# EAGLE design LightSensor (EAGLE 9.6.2)
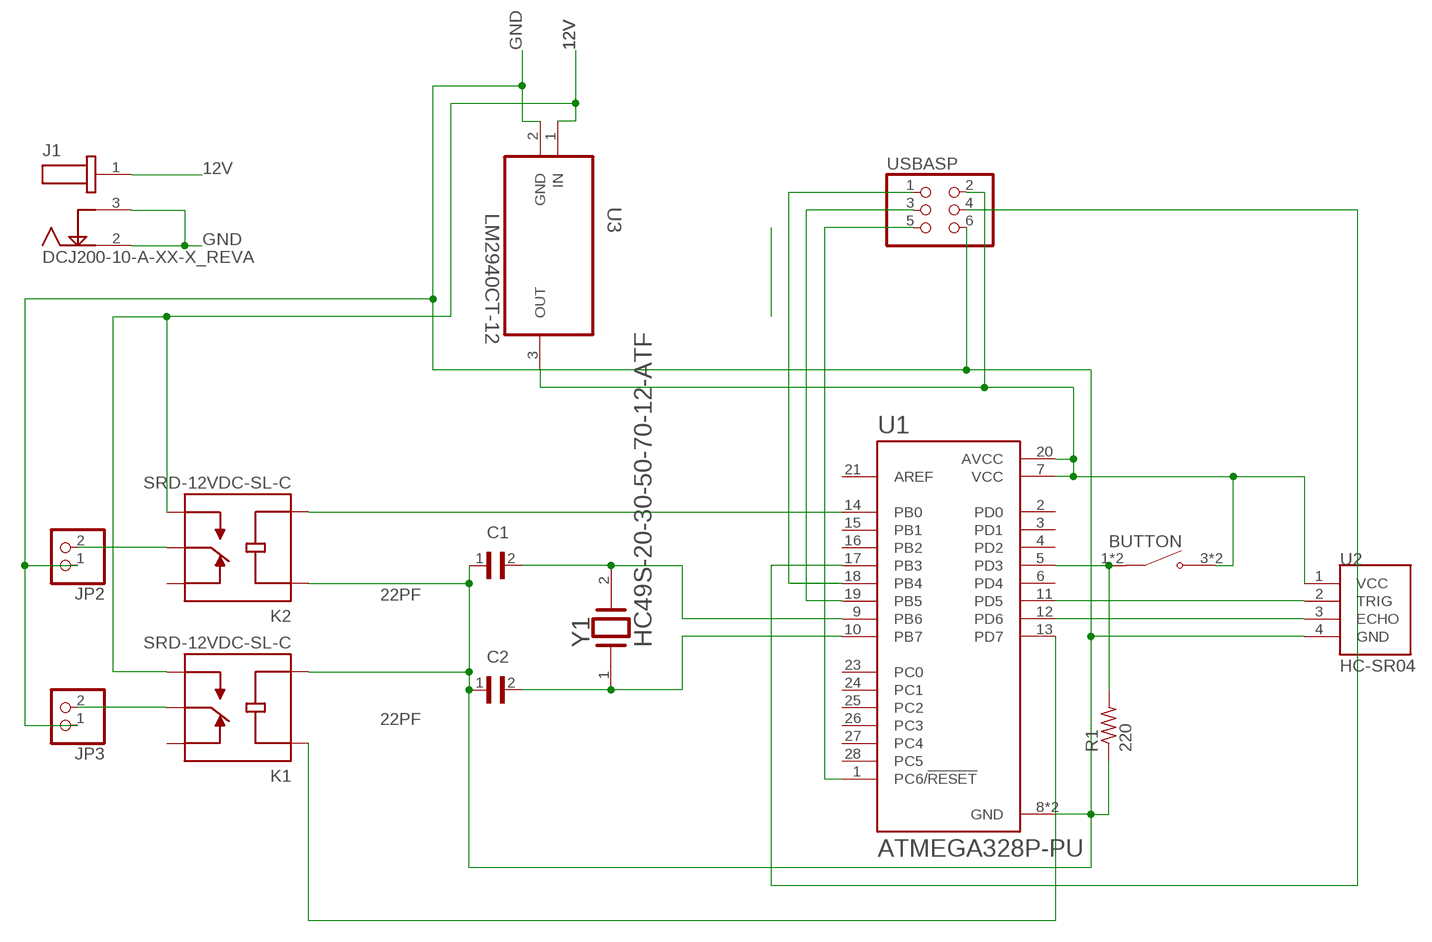
[diagram p0: schematic, sheet 1]

## Parts
C1  22PF  DE21XSA220KN3AX02F  [CAP_DE21XSA220KN3AX02F]
C2  22PF  DE21XSA220KN3AX02F  [CAP_DE21XSA220KN3AX02F]
J1  DCJ200-10-A-XX-X_REVA  [GCT_DCJ200-10-A-XX-X_REVA]
JP2  PINHD-1X2  [1X02]
JP3  PINHD-1X2  [1X02]
K1  SRD-12VDC-SL-C  [RELAY_SRD-12VDC-SL-C]
K2  SRD-12VDC-SL-C  [RELAY_SRD-12VDC-SL-C]
R1  220  R-US_0309/12  [0309/12]
S1  BUTTON  [BUTTON]
U1  ATMEGA328P-PU  [DIP794W46P254L2967H457Q28B]
U2  HC-SR04  [XCVR_HC-SR04]
U3  LM2940CT-12  [TO254P470X1016X2222-3P]
USBASP  PINHD-2X3  [2X03]
Y1  20MHZ  MULTICOMP_HC49S-20-30-50-70-12-ATFMULTICOMP_HC49S-20-30-50-70-12-ATF_0_0  [MULTICOMP_HC49S-20-30-50-70-12-ATF_0]

## Nets
12V: J1.1 K1.NO K2.NO U3.1(IN)
BUTTON: R1.2 S1.1(COM) S1.2(COM) U1.5(PD3)
GND: C1.1 C2.1 J1.2 J1.3 JP2.1 JP3.1 K1.COIL2 K2.COIL1 R1.1 U1.8(GND) U1.22(GND) U2.4(GND) U3.2(GND) USBASP.6
N$2: U1.17(PB3) USBASP.4
N$3: U1.1(PC6/!RESET) USBASP.5
N$4: U1.19(PB5) USBASP.3
N$6: U1.18(PB4) USBASP.1
N$7: C1.2 U1.9(PB6) Y1.2
N$8: C2.2 U1.10(PB7) Y1.1
N$9: U1.11(PD5) U2.2(TRIG)
N$10: U1.12(PD6) U2.3(ECHO)
N$11: K1.COIL1 U1.13(PD7)
N$12: K2.COIL2 U1.14(PB0)
N$13: JP2.2 K2.COM
N$14: JP3.2 K1.COM
N$15: S1.3(NO) S1.4(NO) U1.7(VCC) U1.20(AVCC) U2.1(VCC) U3.3(OUT) USBASP.2
Unconnected: K1.NC K2.NC U1.2(PD0) U1.3(PD1) U1.4(PD2) U1.6(PD4) U1.15(PB1) U1.16(PB2) U1.21(AREF) U1.23(PC0) U1.24(PC1) U1.25(PC2) U1.26(PC3) U1.27(PC4) U1.28(PC5)

## Library data of the parts
C1 C2 = DE21XSA220KN3AX02F:DE21XSA220KN3AX02F: Check prices <https://pricing.snapeda.com/parts/DE21XSA220KN3AX02F/Murata%20Electronics/view-part?ref=eda>; AVAILABILITY: In Stock; DESCRIPTION: 22pF ±10% 300VAC Ceramic Capacitor SL Radial, Disc; MF: Murata Electronics; MP: DE21XSA220KN3AX02F; PACKAGE: NONSTANDARD; PRICE: None; PURCHASE-URL: https://pricing.snapeda.com/search/part/DE21XSA220KN3AX02F/?ref=eda
J1 = DCJ200-10-A-XX-X_REVA:DCJ200-10-A-XX-X_REVA: DC Power Jack, Thru-Hole, Horizontal, with Locating Pegs, D2.0mm Check prices <https://pricing.snapeda.com/parts/DCJ200-10-A-K1-K/Global%20Connector%20Technology/view-part?ref=eda>; AVAILABILITY: In Stock; DESCRIPTION: Power Barrel Connector Jack 2.05mm ID (0.081), 5.50mm OD (0.217) Through Hole, Right Angle; MF: Global Connector Technology; MP: DCJ200-10-A-K1-K; PACKAGE: None; PRICE: None; PURCHASE-URL: https://pricing.snapeda.com/search/part/DCJ200-10-A-K1-K/?ref=eda
JP2 JP3 = pinhead:PINHD-1X2: PIN HEADER
K1 = SRD-12VDC-SL-C:SRD-12VDC-SL-C: General Purpose Non Latching 12VDC SPDT Through Hole Relays RoHS Check prices <https://pricing.snapeda.com/parts/SRD-12VDC-SL-C/Songle%20Relay/view-part?ref=eda>; AVAILABILITY: No availability data; DESCRIPTION: General Purpose Non Latching 12VDC SPDT Through Hole Relays RoHS; MF: Songle Relay; MP: SRD-12VDC-SL-C; PACKAGE: Package; PRICE: None; SPICEPREFIX: X
K2 = SRD-12VDC-SL-C:SRD-12VDC-SL-C: General Purpose Non Latching 12VDC SPDT Through Hole Relays RoHS Check prices <https://pricing.snapeda.com/parts/SRD-12VDC-SL-C/Songle%20Relay/view-part?ref=eda>; AVAILABILITY: No availability data; DESCRIPTION: General Purpose Non Latching 12VDC SPDT Through Hole Relays RoHS; MF: Songle Relay; MP: SRD-12VDC-SL-C; PACKAGE: Package; PRICE: None
R1 = rcl:R-US_: RESISTOR, American symbol; SPICEPREFIX: R
S1 = BUTTON:BUTTON: Check prices <https://pricing.snapeda.com/parts/1571527-1/TE%20Connectivity/view-part?ref=eda>; AVAILABILITY: In Stock; COMMENT: 1571527-1; DESCRIPTION: Switch Tactile OFF (ON) Round Button Gull Wing 0.05A 12VDC 0.98N SMD Bulk; EU_ROHS_COMPLIANCE: Compliant; MF: TE Connectivity; MP: 1571527-1; PACKAGE: SMD-6 Omron Electronics; PRICE: None; PURCHASE-URL: https://pricing.snapeda.com/search/part/1571527-1/?ref=eda
U1 = ATMEGA328P-PU:ATMEGA328P-PU: ATmega Series 20 MHz 32 KB Flash 2 KB SRAM 8-Bit Microcontroller - DIP-28 Check prices <https://pricing.snapeda.com/parts/ATMEGA328P-PU/Microchip/view-part?ref=eda>; AVAILABILITY: In Stock; DESCRIPTION: AVR AVR® ATmega Microcontroller IC 8-Bit 20MHz 32KB (16K x 16) FLASH 28-PDIP; MF: Microchip; MP: ATMEGA328P-PU; PACKAGE: PDIP-28 Microchip; PRICE: None; PURCHASE-URL: https://pricing.snapeda.com/search/part/ATMEGA328P-PU/?ref=eda
U2 = HC-SR04:HC-SR04: Ultrasonic Sensor Module Check prices <https://pricing.snapeda.com/parts/HC-SR04/OSEPP%20Electronics/view-part?ref=eda>; AVAILABILITY: In Stock; DESCRIPTION: Multiple Function Sensor Development Tools Ultrasonic Sensor Module; MF: OSEPP Electronics; MP: HC-SR04; PACKAGE: None; PRICE: None; PURCHASE-URL: https://pricing.snapeda.com/search/part/HC-SR04/?ref=eda; SPICEPREFIX: E
U3 = MOSFET:LM2940CT-12: IC, LDO VOLT REG, 12V, 1A Check prices <https://pricing.snapeda.com/parts/LM2940CT-12/Texas%20Instruments/view-part?ref=eda>; AVAILABILITY: In Stock; DESCRIPTION: 1-A, 26-V, high-PSRR, low-dropout voltage regulator 3-TO-220 0 to 125; MF: Texas Instruments; MP: LM2940CT-12; PACKAGE: TO-220-3 Texas Instruments; PRICE: None; PURCHASE-URL: https://pricing.snapeda.com/search/part/LM2940CT-12/?ref=eda
USBASP = pinhead:PINHD-2X3: PIN HEADER
Y1 = Multicomp - HC49S-20-30-50-70-12-ATF:MULTICOMP_HC49S-20-30-50-70-12-ATF: Crystal; CENTROID_NOT_SPECIFIED: No; DATASHEET: https://upverter.com/datasheet/e5b730a7562fc42878f860c9e3f683a6bf356f6f.pdf; FREQUENCY: 20MHz; FREQUENCY_STABILITY: +/-50ppm; FREQUENCY_TOLERANCE: +/-30ppm; LEAD_FREE: yes; MF: Multicomp; MPN: HC49S-20-30-50-70-12-ATF; PACKAGE: XTAL_4MM65_10MM9; PREFIX: Y; ROHS: yes; TEMPERATURE_RANGE_HIGH: +70°C; TEMPERATURE_RANGE_LOW: -20°C

## Board
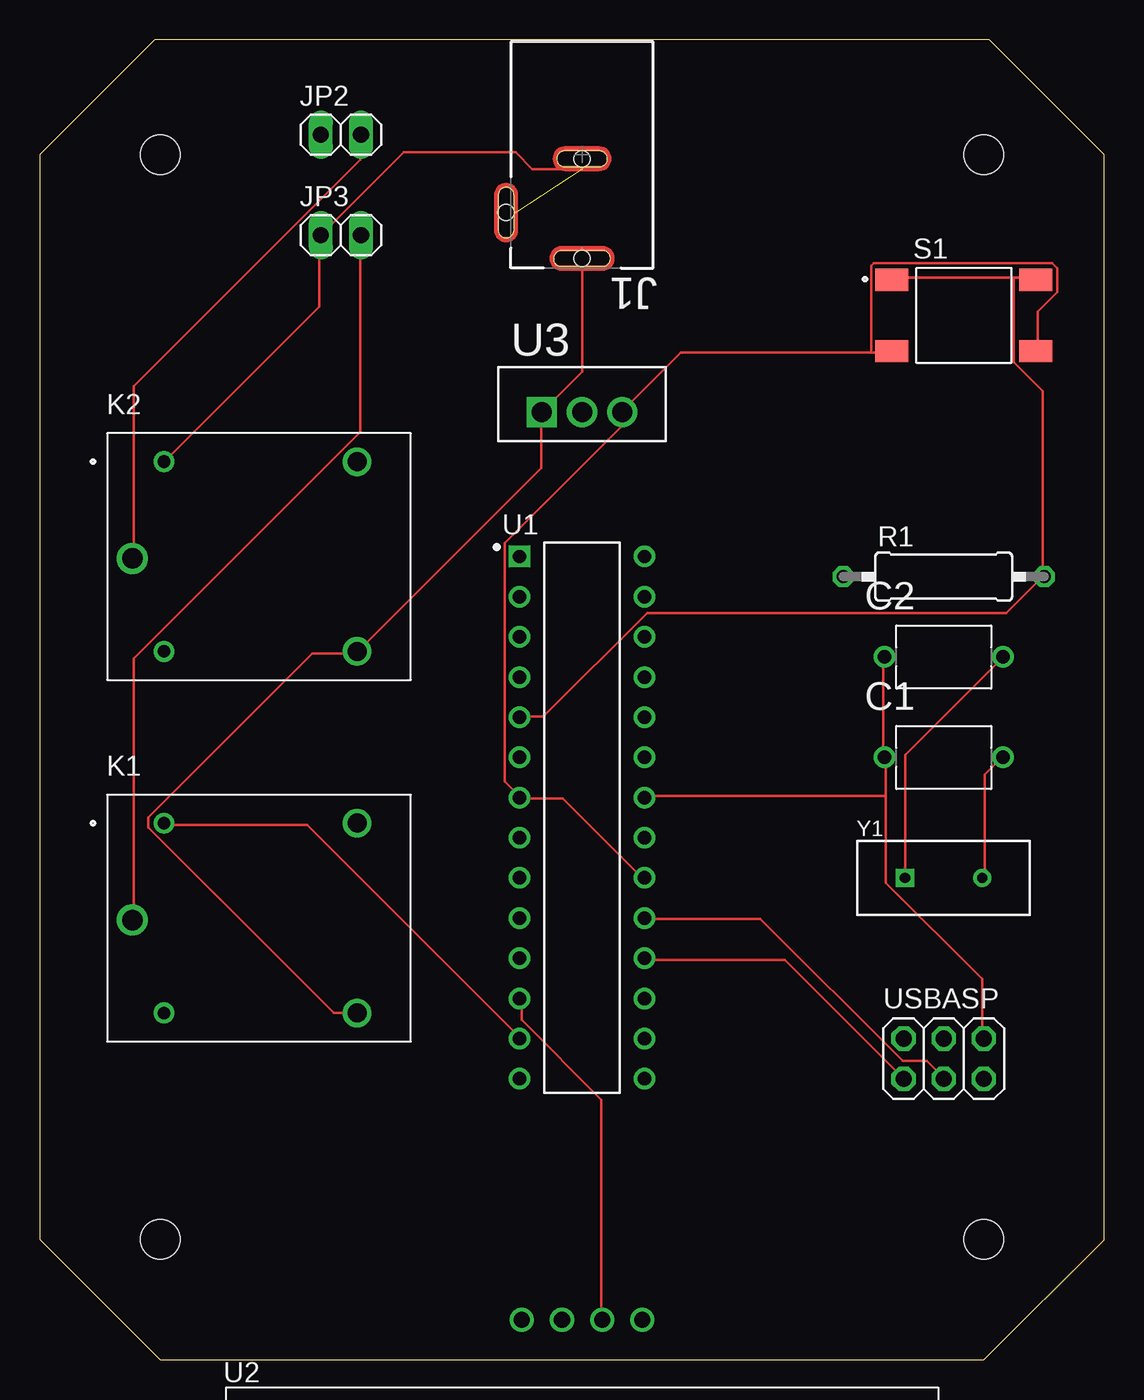
[diagram p1: board, top side]
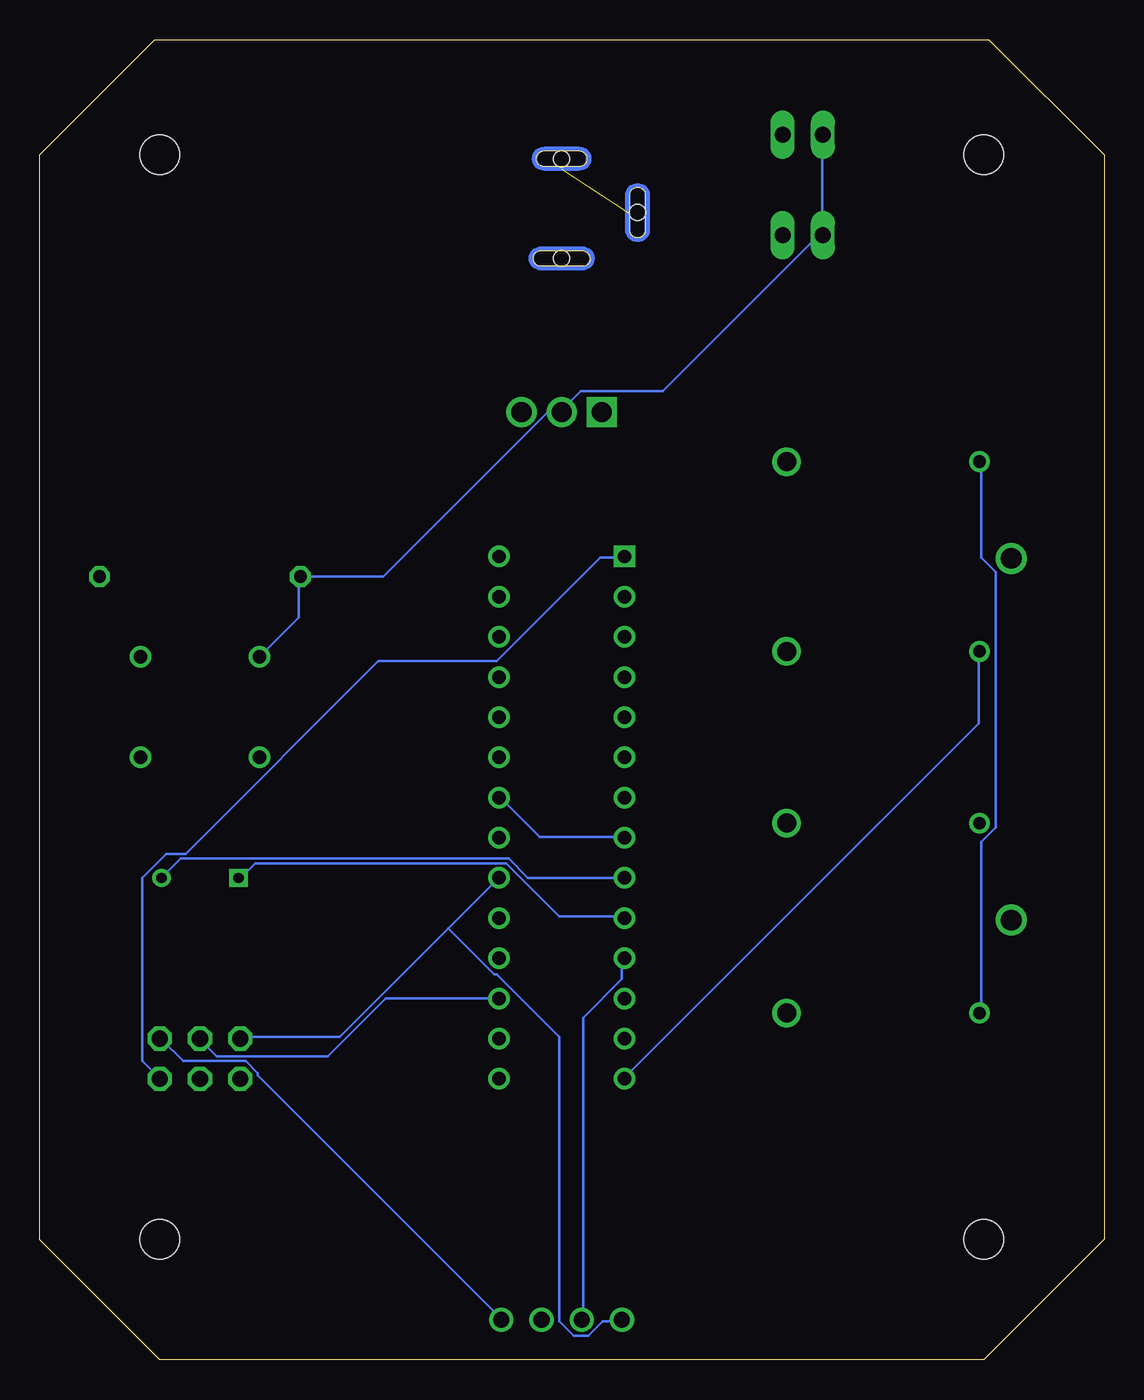
[diagram p2: board, bottom side, seen from below]

Size 67.29 x 83.49 mm. Coordinates in mm from the lower left corner, seen from the top.
Outline: 0,76.2 0,7.62 7.62,0 59.69,0 67.29,7.6 67.29,76.22 60.02,83.49 7.29,83.49 0,76.2
Copper layers (1*16): Top 0.035mm / dielectric 1.5mm / Bottom 0.035mm
Design rules "default": minimum track width 6mil, minimum drill 0.35mm, track to track 6mil, track to pad 6mil, pad to pad 6mil, via to via 6mil, smd to smd 6mil, copper to edge 40mil, drill to drill 6mil, minimum pad ring 10mil, minimum via ring 8mil, stop-mask expansion 4mil, vias tented up to drill 0mil, thermal gap 10mil
Holes 2.5 mm at 7.62,76.2 59.69,76.2 7.62,7.62 59.69,7.62

### Footprints (pad centres in the part's own frame; a part is rotated, then mirrored left to right if it is on the bottom)
CAP_DE21XSA220KN3AX02F = drill 0.85 pad 1.28: 1 -3.75,0; 2 3.75,0
GCT_DCJ200-10-A-XX-X_REVA = smd 0.1 x 0.1: 1 0,5.95; 2 0,0.9; 3 4.2,3.65 | hole 1: 0,0.25; 4.8,3.65; 0,6.55
1X02 = drill 1.016 long: 1 -1.27,0; 2 1.27,0
RELAY_SRD-12VDC-SL-C = drill 0.8: COIL1 -6.1,6; COIL2 -6.1,-6 | drill 1.3: COM -8.1,-0.12 | drill 1.2: NC 6.1,6; NO 6.1,-6
0309/12 = drill 0.813 octagon: 1 -6.35,0; 2 6.35,0
BUTTON = smd 2.1 x 1.4: 1 -4.55,2.25; 2 4.55,2.25; 3 -4.55,-2.25; 4 4.55,-2.25
DIP794W46P254L2967H457Q28B = drill 0.85 square: 1 -3.96,16.51 | drill 0.85: 2 -3.96,13.97; 3 -3.96,11.43; 4 -3.96,8.89; 5 -3.96,6.35; 6 -3.96,3.81; 7 -3.96,1.27; 8 -3.96,-1.27; 9 -3.96,-3.81; 10 -3.96,-6.35; 11 -3.96,-8.89; 12 -3.96,-11.43; 13 -3.96,-13.97; 14 -3.96,-16.51; 15 3.96,-16.51; 16 3.96,-13.97; 17 3.96,-11.43; 18 3.96,-8.89; 19 3.96,-6.35; 20 3.96,-3.81; 21 3.96,-1.27; 22 3.96,1.27; 23 3.96,3.81; 24 3.96,6.35; 25 3.96,8.89; 26 3.96,11.43; 27 3.96,13.97; 28 3.96,16.51
XCVR_HC-SR04 = drill 1.02: 1 -3.81,0; 2 -1.27,0; 3 1.27,0; 4 3.81,0
TO254P470X1016X2222-3P = drill 1.27 square: 1 -5.08,-1.016 | drill 1.27: 2 -2.54,-1.016; 3 0,-1.016
2X03 = drill 1.016 octagon: 1 -2.54,-1.27; 2 -2.54,1.27; 3 0,-1.27; 4 0,1.27; 5 2.54,-1.27; 6 2.54,1.27
MULTICOMP_HC49S-20-30-50-70-12-ATF_0 = drill 0.65 pad 1.15 square: 1 -2.44,0 | drill 0.65 pad 1.15: 2 2.44,0

### Placement (x,y rotation side)
C1  57.15,38.1 0 top
C2  57.15,44.45 0 top
J1  34.29,76.2 180 top
JP2  19.05,77.47 0 top
JP3  19.05,71.12 0 top
K1  13.97,27.94 0 top
K2  13.97,50.8 0 top
R1  57.15,49.53 0 top
S1  58.42,66.04 0 top
U1  34.29,34.29 0 top
U2  34.29,2.54 0 top
U3  36.83,60.96 0 top
USBASP  57.15,19.05 0 top
Y1  57.15,30.48 0 top

### Tracks (layer width: path | path; a pad name or v marks a point on that pad's centre or on a via)
12V
  Top 0.152: K1.NO 19.96,21.95 18.59,21.95 6.86,33.68 6.86,34.29 17.22,44.65 19.96,44.65 K2.NO 20.12,44.81 31.7,56.39 31.7,59.89 U3.1 34.29,62.48 J1.1
BUTTON
  Top 0.152: 61.57,68.43 62.94,68.43 S1.2 | 61.57,68.43 53.95,68.43 S1.1 | 63.4,49.53 63.4,61.27 61.57,63.09 61.57,68.43 | 63.4,49.53 61.11,47.24 38.41,47.24 31.85,40.69 30.48,40.69 U1.5 | 63.4,49.53 R1.2
GND  (1 unrouted)
  Top 0.152: K2.COIL1 7.92,56.84 17.68,66.6 17.68,71.02 JP3.1 23.02,76.36 30.09,76.36 31.15,75.3 J1.2 | C2.1 53.34,44.35 53.34,38.1 C1.1 53.49,38.1 53.49,35.66 | 53.49,35.66 53.49,30.18 59.59,24.08 59.59,20.42 USBASP.6 | 53.49,35.66 38.25,35.66 U1.22
  Bottom 0.152: JP2.1 17.83,77.42 17.83,71.17 JP3.1 17.83,71.02 18.14,71.02 27.89,61.27 33.07,61.27 34.29,60.05 U3.2 34.29,59.89 35.2,59.89 45.57,49.53 R1.1 50.9,49.53 50.9,46.94 53.34,44.5 C2.1 | K1.COIL2 7.77,21.95 7.77,32.77 6.86,33.68 6.86,49.84 7.77,50.75 7.77,56.69 K2.COIL1 | U1.8 30.48,33.07 35.66,33.07 38.1,35.51 U1.22 | U2.4 38.1,2.59 53.49,17.98 53.49,18.14 54.25,18.9 58.22,18.9 59.59,20.27 USBASP.6
N$2
  Bottom 0.152: U1.17 45.41,22.86 49.07,19.2 56.08,19.2 57.15,20.27 USBASP.4
N$3
  Bottom 0.152: USBASP.5 60.81,18.9 60.81,30.48 59.28,32 58.06,32 45.87,44.2 38.41,44.2 31.85,50.75 30.48,50.75 U1.1
N$4
  Top 0.152: U1.19 38.25,27.89 45.57,27.89 54.56,18.9 56.08,18.9 57.15,17.83 USBASP.3
N$6
  Top 0.152: USBASP.1 47.09,25.3 38.25,25.3 U1.18
N$7
  Top 0.152: Y1.2 59.74,30.48 59.74,37.03 60.81,38.1 C1.2
  Bottom 0.152: U1.9 36.42,30.48 37.64,31.7 58.37,31.7 Y1.2
N$8
  Top 0.152: Y1.1 54.71,38.25 60.81,44.35 C2.2
  Bottom 0.152: U1.10 30.48,28.04 34.44,28.04 37.8,31.39 53.65,31.39 54.56,30.48 Y1.1
N$9
  Bottom 0.152: U1.11 30.48,25.3 30.48,24.08 32.92,21.64 32.92,2.59 U2.2
N$10
  Top 0.152: U1.12 30.48,22.86 30.48,21.49 35.51,16.46 35.51,2.59 U2.3
N$11
  Top 0.152: K1.COIL1 7.92,33.83 16.92,33.83 30.33,20.42 U1.13
N$12
  Bottom 0.152: K2.COIL2 7.92,44.65 7.92,40.23 30.33,17.83 U1.14
N$13
  Top 0.152: JP2.2 20.27,77.42 20.27,75.89 5.94,61.57 5.94,50.75 K2.COM
N$14
  Top 0.152: JP3.2 20.27,71.02 20.27,58.67 5.94,44.35 5.94,27.89 K1.COM
N$15
  Top 0.152: 52.58,63.7 40.54,63.7 36.88,60.05 U3.3 36.73,59.89 36.73,58.98 29.41,51.66 29.41,36.58 30.33,35.66 U1.7 30.48,35.51 33.07,35.51 38.1,30.48 U1.20 | 52.58,63.7 53.8,63.7 S1.3 | 52.58,63.7 52.58,69.19 52.73,69.34 64.01,69.34 64.31,69.04 64.31,67.51 63.09,66.29 63.09,63.86 S1.4
  Bottom 0.152: 41.45,27.28 U1.20 | 41.45,27.28 48.31,20.42 54.56,20.42 USBASP.2 | 41.45,27.28 38.56,24.38 38.41,24.38 34.44,20.42 34.44,2.44 33.53,1.52 32.61,1.52 31.7,2.44 30.48,2.44 U2.1